# Altium schematic sheet AFE.SchDoc
size A2
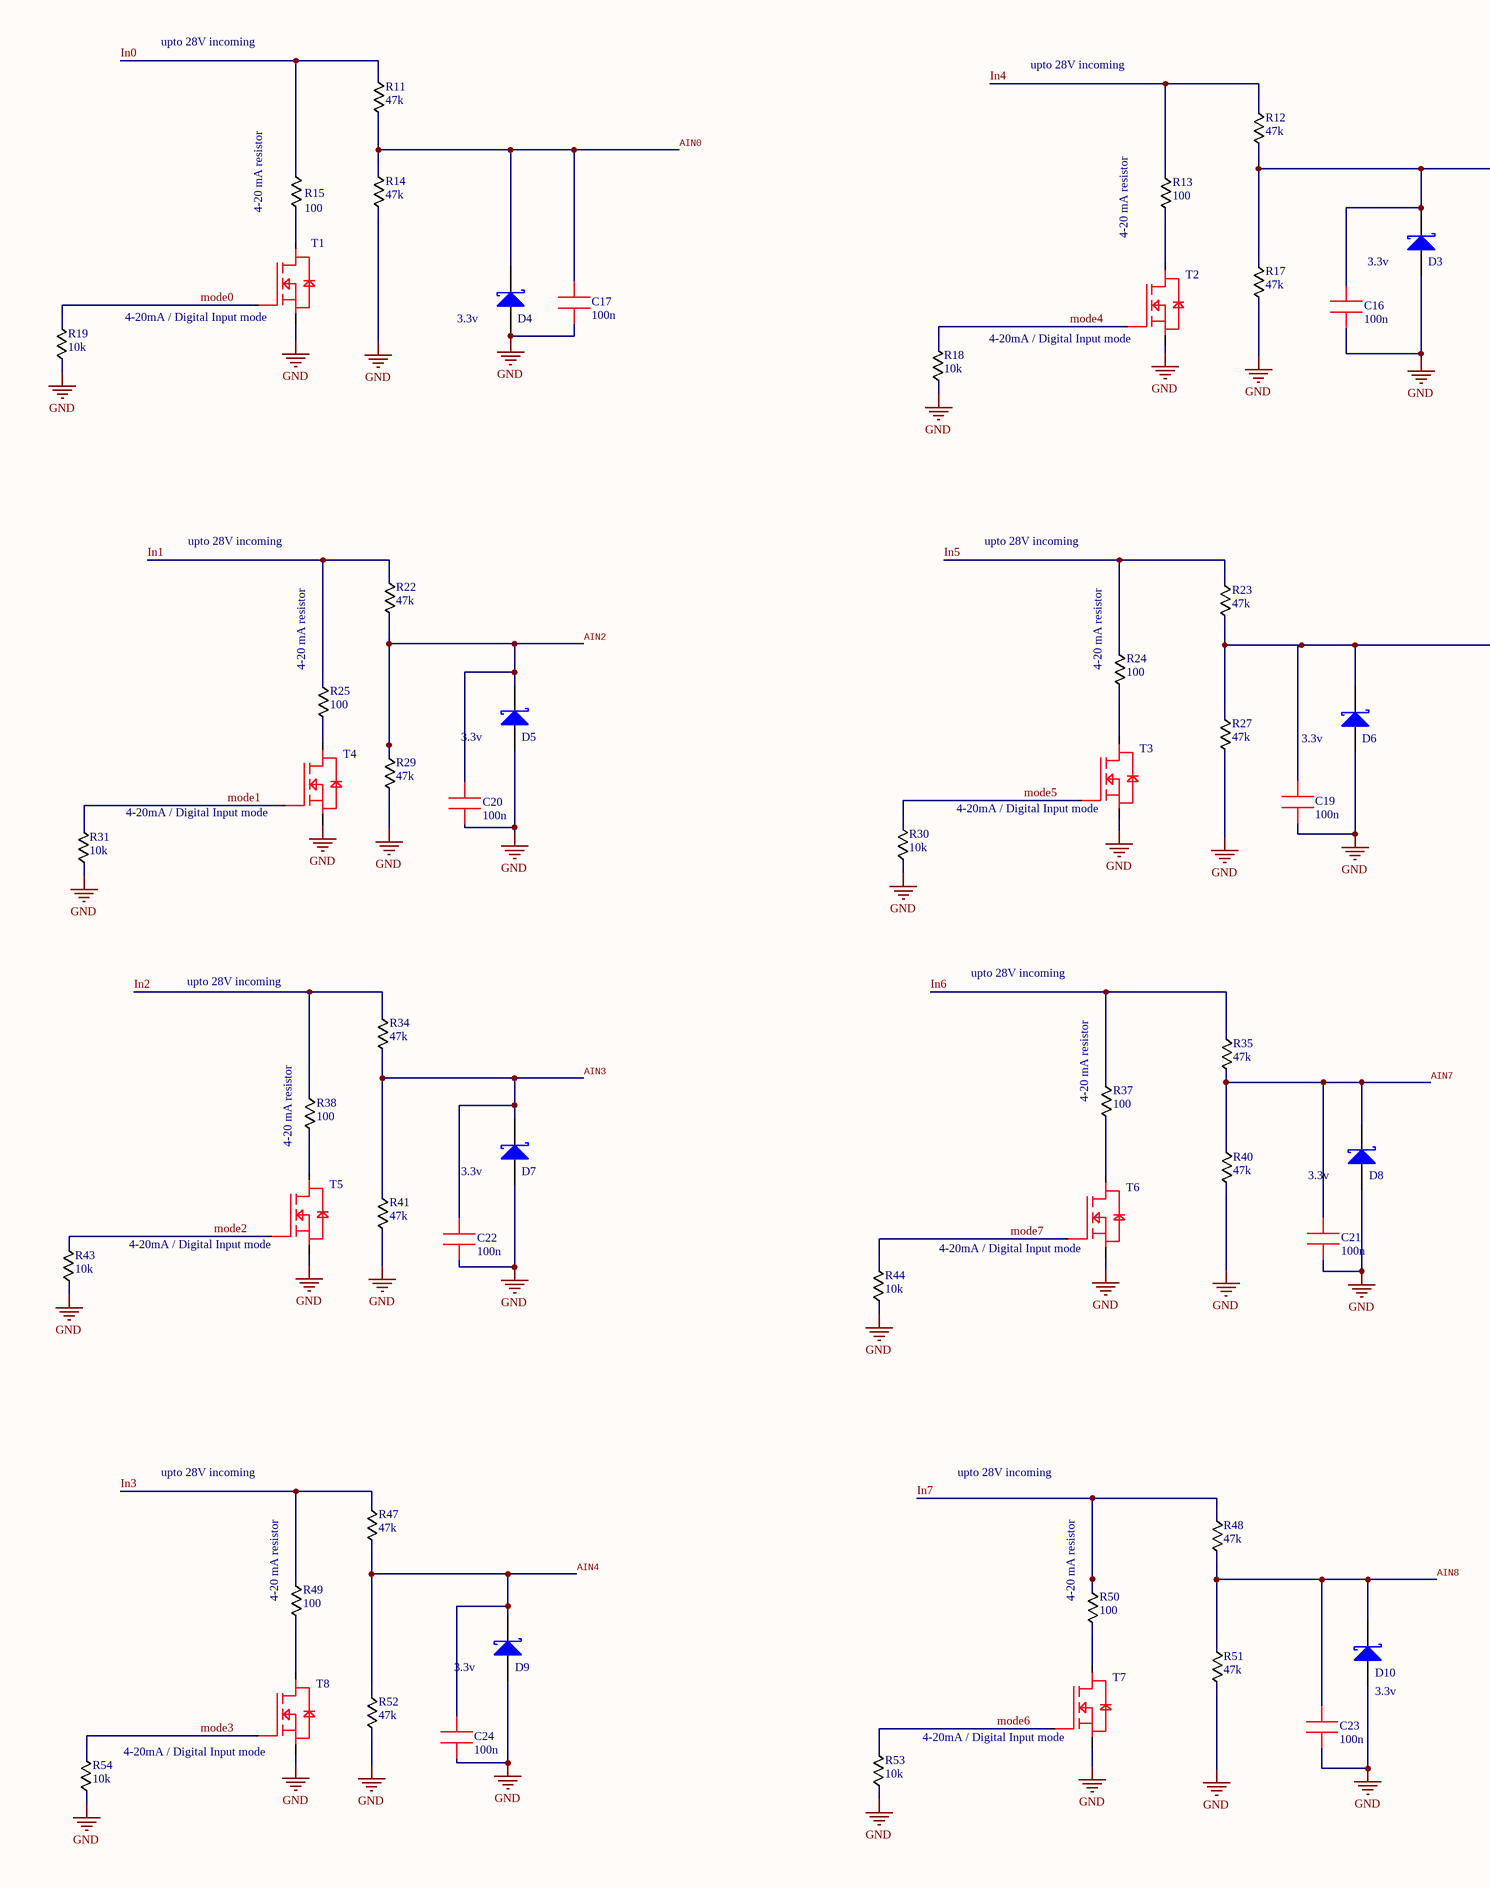
[diagram p0: AFE.SchDoc, left]
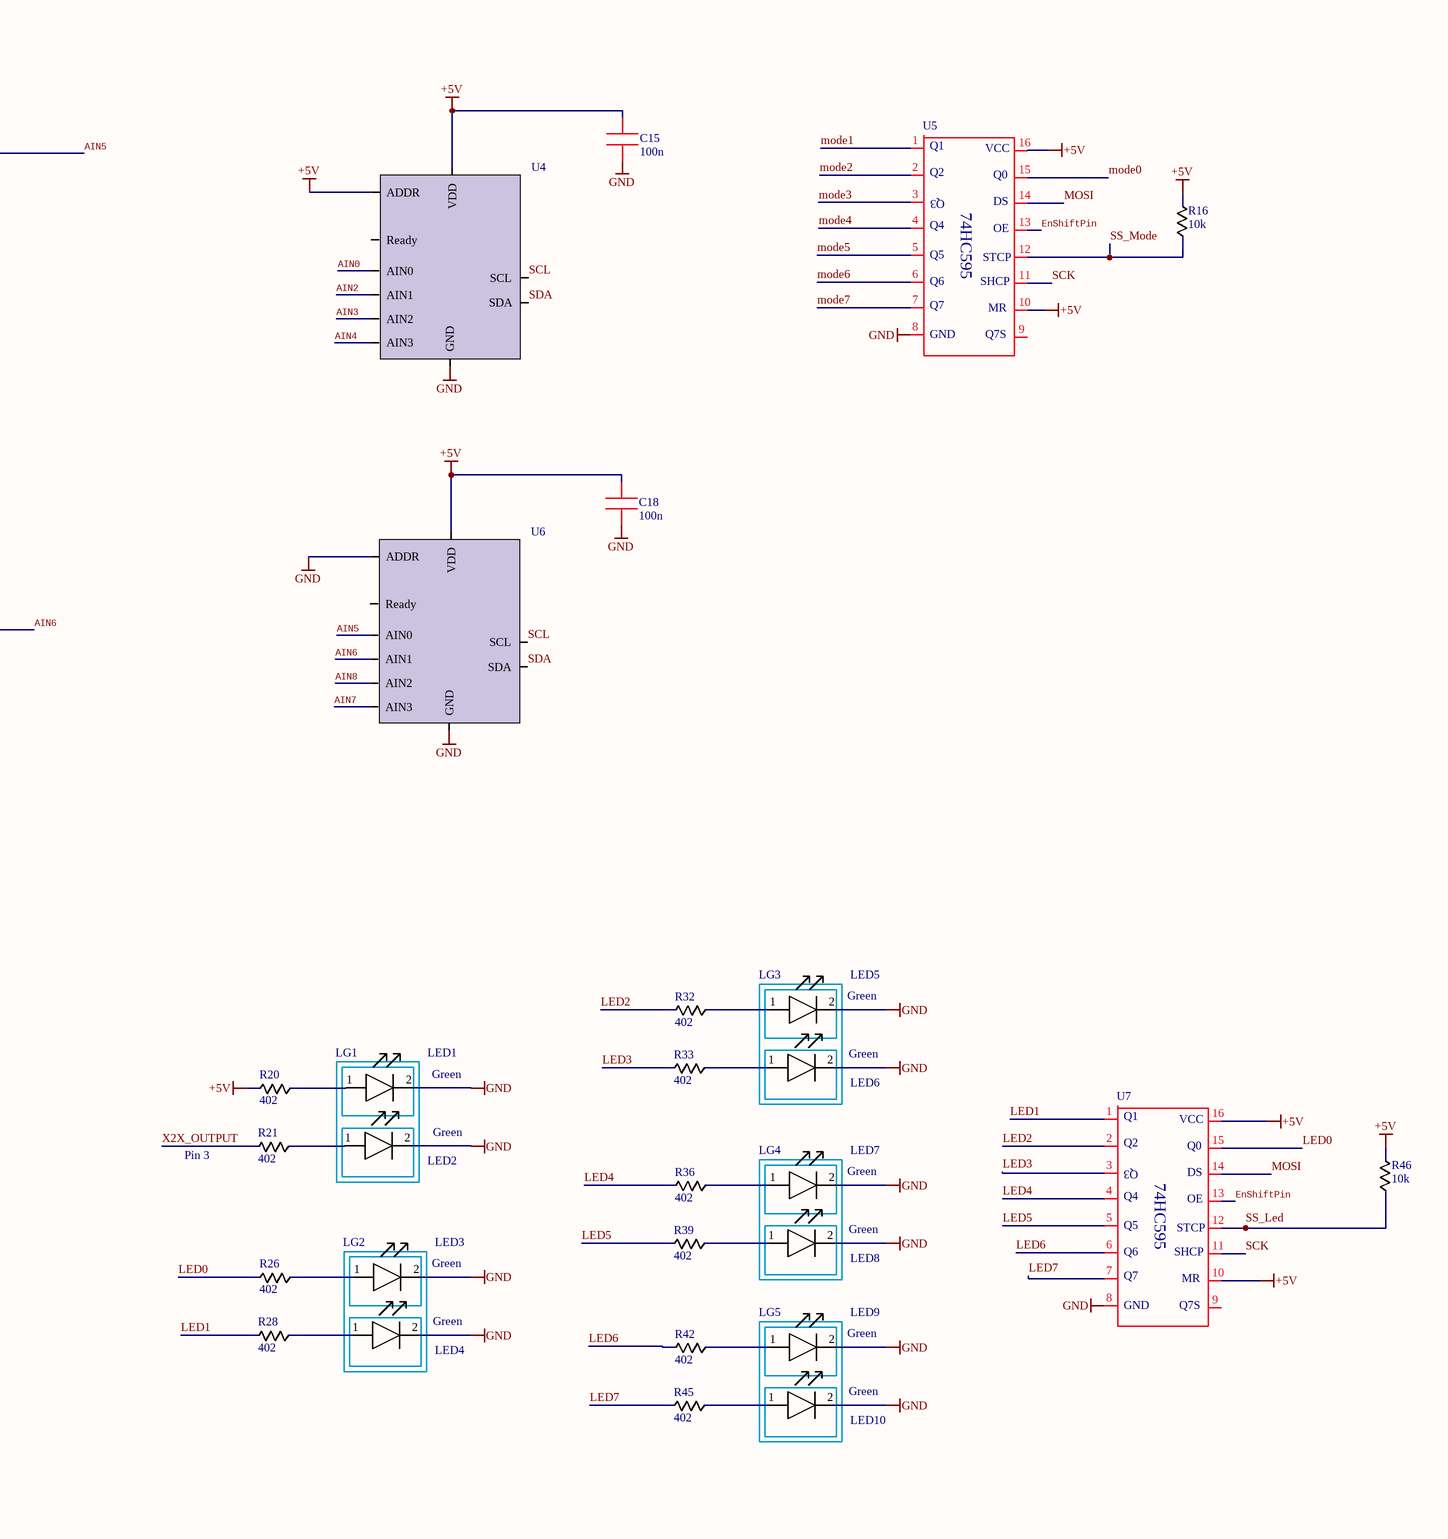
[diagram p1: AFE.SchDoc, right]

## Parts
C15  100n  [0603 - Cap]
C16  100n  [0603 - Cap]
C17  100n  [0603 - Cap]
C18  100n  [0603 - Cap]
C19  100n  [0603 - Cap]
C20  100n  [0603 - Cap]
C21  100n  [0603 - Cap]
C22  100n  [0603 - Cap]
C23  100n  [0603 - Cap]
C24  100n  [0603 - Cap]
D3  3.3v  [SOT23]
D4  3.3v  [SOT23]
D5  3.3v  [SOT23]
D6  3.3v  [SOT23]
D7  3.3v  [SOT23]
D8  3.3v  [SOT23]
D9  3.3v  [SOT23]
D10  3.3v  [SOT23]
LED1  (no value)  [0603 - LED]
LED2  (no value)  [0603 - LED]
LED3  (no value)  [0603 - LED]
LED4  (no value)  [0603 - LED]
LED5  (no value)  [0603 - LED]
LED6  (no value)  [0603 - LED]
LED7  (no value)  [0603 - LED]
LED8  (no value)  [0603 - LED]
LED9  (no value)  [0603 - LED]
LED10  (no value)  [0603 - LED]
LG1  (no value)  [LED SMD DayLight]
LG2  (no value)  [LED SMD DayLight]
LG3  (no value)  [LED SMD DayLight]
LG4  (no value)  [LED SMD DayLight]
LG5  (no value)  [LED SMD DayLight]
R11  47k  [0603_Res]
R12  47k  [0603_Res]
R13  100  [0805_Res]
R14  47k  [0603_Res]
R15  100  [0805_Res]
R16  10k  [0603_Res]
R17  47k  [0603_Res]
R18  10k  [0603_Res]
R19  10k  [0603_Res]
R20  402  [0603_Res]
R21  402  [0603_Res]
R22  47k  [0603_Res]
R23  47k  [0603_Res]
R24  100  [0805_Res]
R25  100  [0805_Res]
R26  402  [0603_Res]
R27  47k  [0603_Res]
R28  402  [0603_Res]
R29  47k  [0603_Res]
R30  10k  [0603_Res]
R31  10k  [0603_Res]
R32  402  [0603_Res]
R33  402  [0603_Res]
R34  47k  [0603_Res]
R35  47k  [0603_Res]
R36  402  [0603_Res]
R37  100  [0805_Res]
R38  100  [0805_Res]
R39  402  [0603_Res]
R40  47k  [0603_Res]
R41  47k  [0603_Res]
R42  402  [0603_Res]
R43  10k  [0603_Res]
R44  10k  [0603_Res]
R45  402  [0603_Res]
R46  10k  [0603_Res]
R47  47k  [0603_Res]
R48  47k  [0603_Res]
R49  100  [0805_Res]
R50  100  [0805_Res]
R51  47k  [0603_Res]
R52  47k  [0603_Res]
R53  10k  [0603_Res]
R54  10k  [0603_Res]
T1  (no value)  [SOT23]
T2  (no value)  [SOT23]
T3  (no value)  [SOT23]
T4  (no value)  [SOT23]
T5  (no value)  [SOT23]
T6  (no value)  [SOT23]
T7  (no value)  [SOT23]
T8  (no value)  [SOT23]
U4  (no value)  [VSSOP-10]
U5  (no value)  [74HC595 Led Driver]
U6  (no value)  [VSSOP-10]
U7  (no value)  [74HC595 Led Driver]

## Nets
+5V: C15.2 C18.2 R16.2 R20.2 R46.2 U4.1(ADDR) U4.8(VDD) U5.10 U5.16 U6.8(VDD) U7.10 U7.16
GND: C15.1 C16.1 C17.1 C18.1 C19.1 C20.1 C21.1 C22.1 C23.1 C24.1 D3.1(A) D4.1(A) D5.1(A) D6.1(A) D7.1(A) D8.1(A) D9.1(A) D10.1(A) LED1.2 LED2.2 LED3.2 LED4.2 LED5.2 LED6.2 LED7.2 LED8.2 LED9.2 LED10.2 R14.2 R17.2 R18.1 R19.1 R27.2 R29.2 R30.1 R31.1 R40.2 R41.2 R43.1 R44.1 R51.2 R52.2 R53.1 R54.1 T1.2 T2.2 T3.2 T4.2 T5.2 T6.2 T7.2 T8.2 U4.3(GND) U5.8 U6.1(ADDR) U6.3(GND) U7.8
AIN0: C17.2 D4.3(K) R11.2 R14.1 U4.4(AIN0)
AIN2: C20.2 D5.3(K) R22.2 R29.1 U4.5(AIN1)
AIN3: C22.2 D7.3(K) R34.2 R41.1 U4.6(AIN2)
AIN4: C24.2 D9.3(K) R47.2 R52.1 U4.7(AIN3)
AIN5: C16.2 D3.3(K) R12.2 R17.1 U6.4(AIN0)
AIN6: C19.2 D6.3(K) R23.2 R27.1 U6.5(AIN1)
AIN7: C21.2 D8.3(K) R35.2 R40.1 U6.7(AIN3)
AIN8: C23.2 D10.3(K) R48.2 R51.1 U6.6(AIN2)
EnShiftPin: U5.13 U7.13
In0: R11.1 R15.1
In1: R22.1 R25.1
In2: R34.1 R38.1
In3: R47.1 R49.1
In4: R12.1 R13.1
In5: R23.1 R24.1
In6: R35.1 R37.1
In7: R48.1 R50.1
LED0: R26.2 U7.15
LED1: R28.2 U7.1
LED2: R32.2 U7.2
LED3: R33.2 U7.3
LED4: R36.2 U7.4
LED5: R39.2 U7.5
LED6: R42.2 U7.6
LED7: R45.2 U7.7
mode0: R19.2 T1.1 U5.15
mode1: R31.2 T4.1 U5.1
mode2: R43.2 T5.1 U5.2
mode3: R54.2 T8.1 U5.3
mode4: R18.2 T2.1 U5.4
mode5: R30.2 T3.1 U5.5
mode6: R53.2 T7.1 U5.6
mode7: R44.2 T6.1 U5.7
MOSI: U5.14 U7.14
SCK: U5.11 U7.11
SCL: U4.10(SCL) U6.10(SCL)
SDA: U4.9(SDA) U6.9(SDA)
SS_Led: R46.1 U7.12
SS_Mode: R16.1 U5.12
X2X_OUTPUT: R21.2
NetLED1_1: LED1.1 R20.1
NetLED2_1: LED2.1 R21.1
NetLED3_1: LED3.1 R26.1
NetLED4_1: LED4.1 R28.1
NetLED5_1: LED5.1 R32.1
NetLED6_1: LED6.1 R33.1
NetLED7_1: LED7.1 R36.1
NetLED8_1: LED8.1 R39.1
NetLED9_1: LED9.1 R42.1
NetLED10_1: LED10.1 R45.1
NetR13_2: R13.2 T2.3
NetR15_2: R15.2 T1.3
NetR24_2: R24.2 T3.3
NetR25_2: R25.2 T4.3
NetR37_2: R37.2 T6.3
NetR38_2: R38.2 T5.3
NetR49_2: R49.2 T8.3
NetR50_2: R50.2 T7.3

Not connected (* = marked no-connect by the designer): U4 2(Ready); U5 9(1); U6 2(Ready); U7 9(1)

## Notes on the sheet
- upto 28V incoming
- 4-20 mA resistor
- (near T1) 4-20mA / Digital Input mode
- (near T2) 4-20mA / Digital Input mode
- (near R25) 4-20 mA resistor
- (near R24) 4-20 mA resistor
- (near T4) 4-20mA / Digital Input mode
- (near T3) 4-20mA / Digital Input mode
- (near LED5) Green
- (near R37) 4-20 mA resistor
- (near LED1) Green
- Green
- (near R38) 4-20 mA resistor
- (near R21) Pin 3
- (near T5) 4-20mA / Digital Input mode
- (near T6) 4-20mA / Digital Input mode
- (near LED7) Green
- (near LED3) Green
- (near LED9) Green
- (near R49) 4-20 mA resistor
- (near R50) 4-20 mA resistor
- (near T8) 4-20mA / Digital Input mode
- (near T7) 4-20mA / Digital Input mode
- (in symbol 74HC595 Led Driver) Q1; VCC; Q2; Q0; Q3; DS; Q4; OE; Q5; STCP; Q6; SHCP; Q7; MR; GND; Q7S

## Library data of the parts
C15-C24 = 0805 Cap: Part Description: Ceramic Capacitors SMD 50 V 0.1uF X7R 0603 10%; Part Number: CC0603KRX7R9BB104
D3-D10 = Diode BAT17: Part Description: Zener, SOT-23, 3.3V, 0.3W, 2%; Part Number: BZX84B3V3; Note: Pin 2 is not connected and not drawn.; Published: 21-Mar-2003; LatestRevisionDate: 29-May-2009; LatestRevisionNote: IPC-7351 Footprint Added.; DatasheetVersion: Oct-1999; PackageVersion: Sep-2001; PackageReference: SOT-23; Publisher: Altium Limited; PackageDescription: 3-Pin SOT-23 Package 0.95 mm Pitch, 2.5 mm Lead Span; ComponentLink1Description: Manufacturer Link; ComponentLink1URL: http://www.infineon.com/; ComponentLink2Description: Datasheet; ComponentLink2URL: http://www.infineon.com/upload/Document/cmc_upload/documents/009/363/bat17series.pdf
LED1-LED10 = LED 0603: Part Number: KP-1608SGC; Part Description: 0603 Single Colour LED Green
LG1-LG5 = Light Guide 2: Part Number: 5151094F; Part Description: Light Guide
R11 R12 R14 R17 R22 R23 R27 R29 R34 R35 R40 R41 R47 R48 R51 R52 = Resistor 0805: Part Description: Resistor 0603, 47kOhms, 1%, 1/10W; Part Number: RC0603FR-0747KL
R13 R15 R24 R25 R37 R38 R49 R50 = Resistor 0805: Part Description: Resistor SMD 1/8W 100 ohm .1% 25p pm; Part Number: RT0805BRD07100RL
R16 R46 = Resistor 0805: RC0603JR-0710K; Part Description: SMD  Resistor 0603, 10kOhms, 1%, 1/10W; Part Number: RC0603FR-0710KL
R18 R19 R30 R31 R43 R44 R53 R54 = Resistor 0805: Part Description: SMD  Resistor 0603, 10kOhms, 1%, 1/10W; Part Number: RC0603FR-0710KL
R20 R21 R26 R28 R32 R33 R36 R39 R42 R45 = Resistor 0805: RC0603FR-07402RL; Part Description: Resistor 0603, 402Ohms, 1%, 1/10W; Part Number: RC0603FR-07402RL
T1-T8 = IRLML2402: Part Description: MOSFET SOT-23 N-CH LOGIC; Part Number: BSS138
U4 U6 = ADS1115: Part Description: ADC 16B ADC 4ch MUX; Part Number: ADS1115IDGSR
U5 U7 = 74HC595 Led Driver: Part Description: 8-Bit Shift Register/Latch; Part Number: 74HC595